# EasyEDA Pro project ProProject_Open Energy Box_2024-08-12.epro, board PCB1
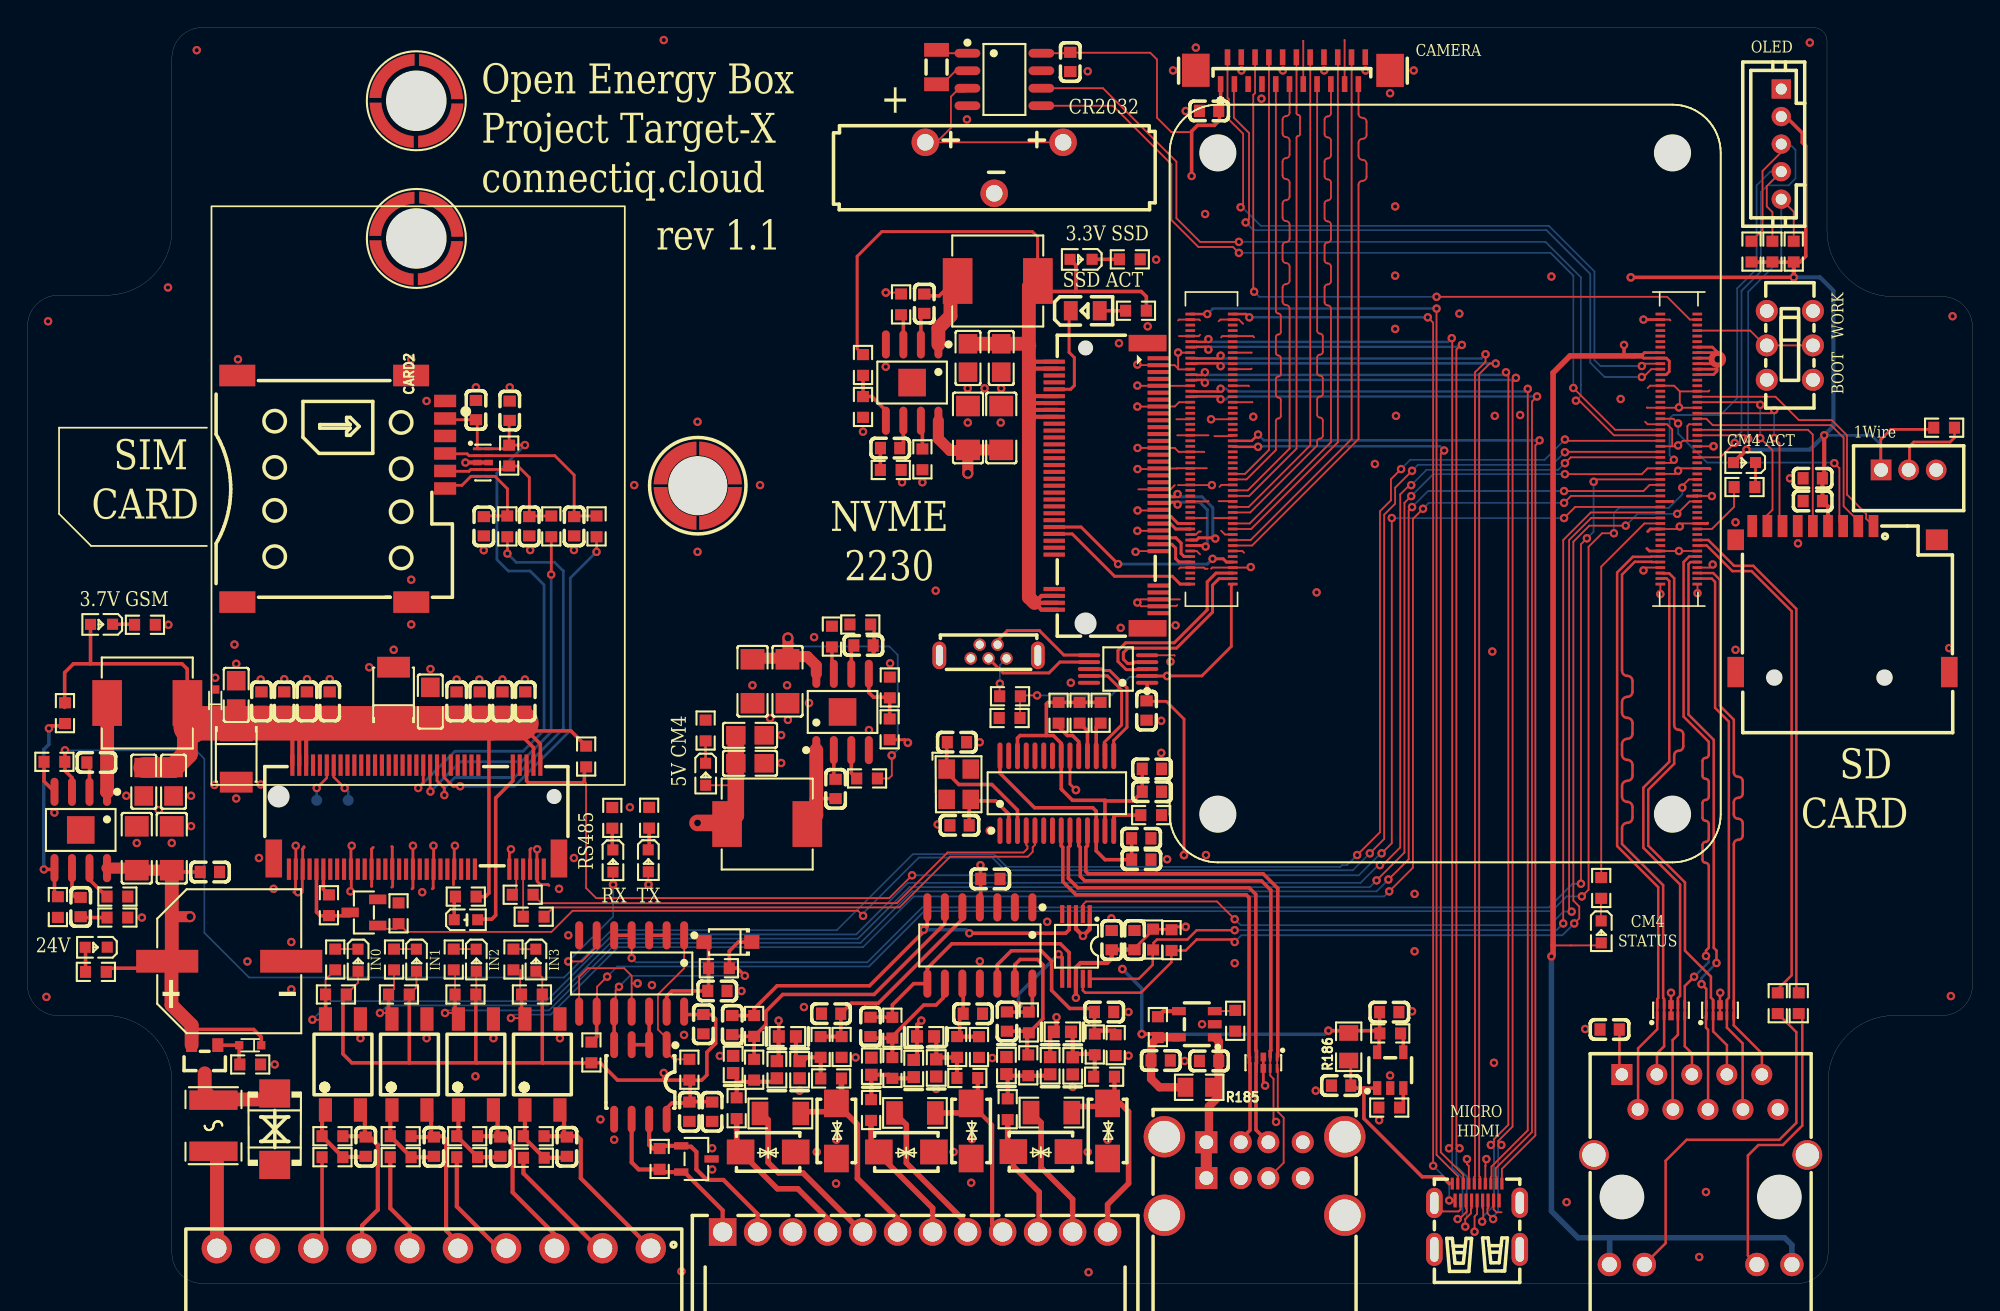
[diagram p13: board, top side]
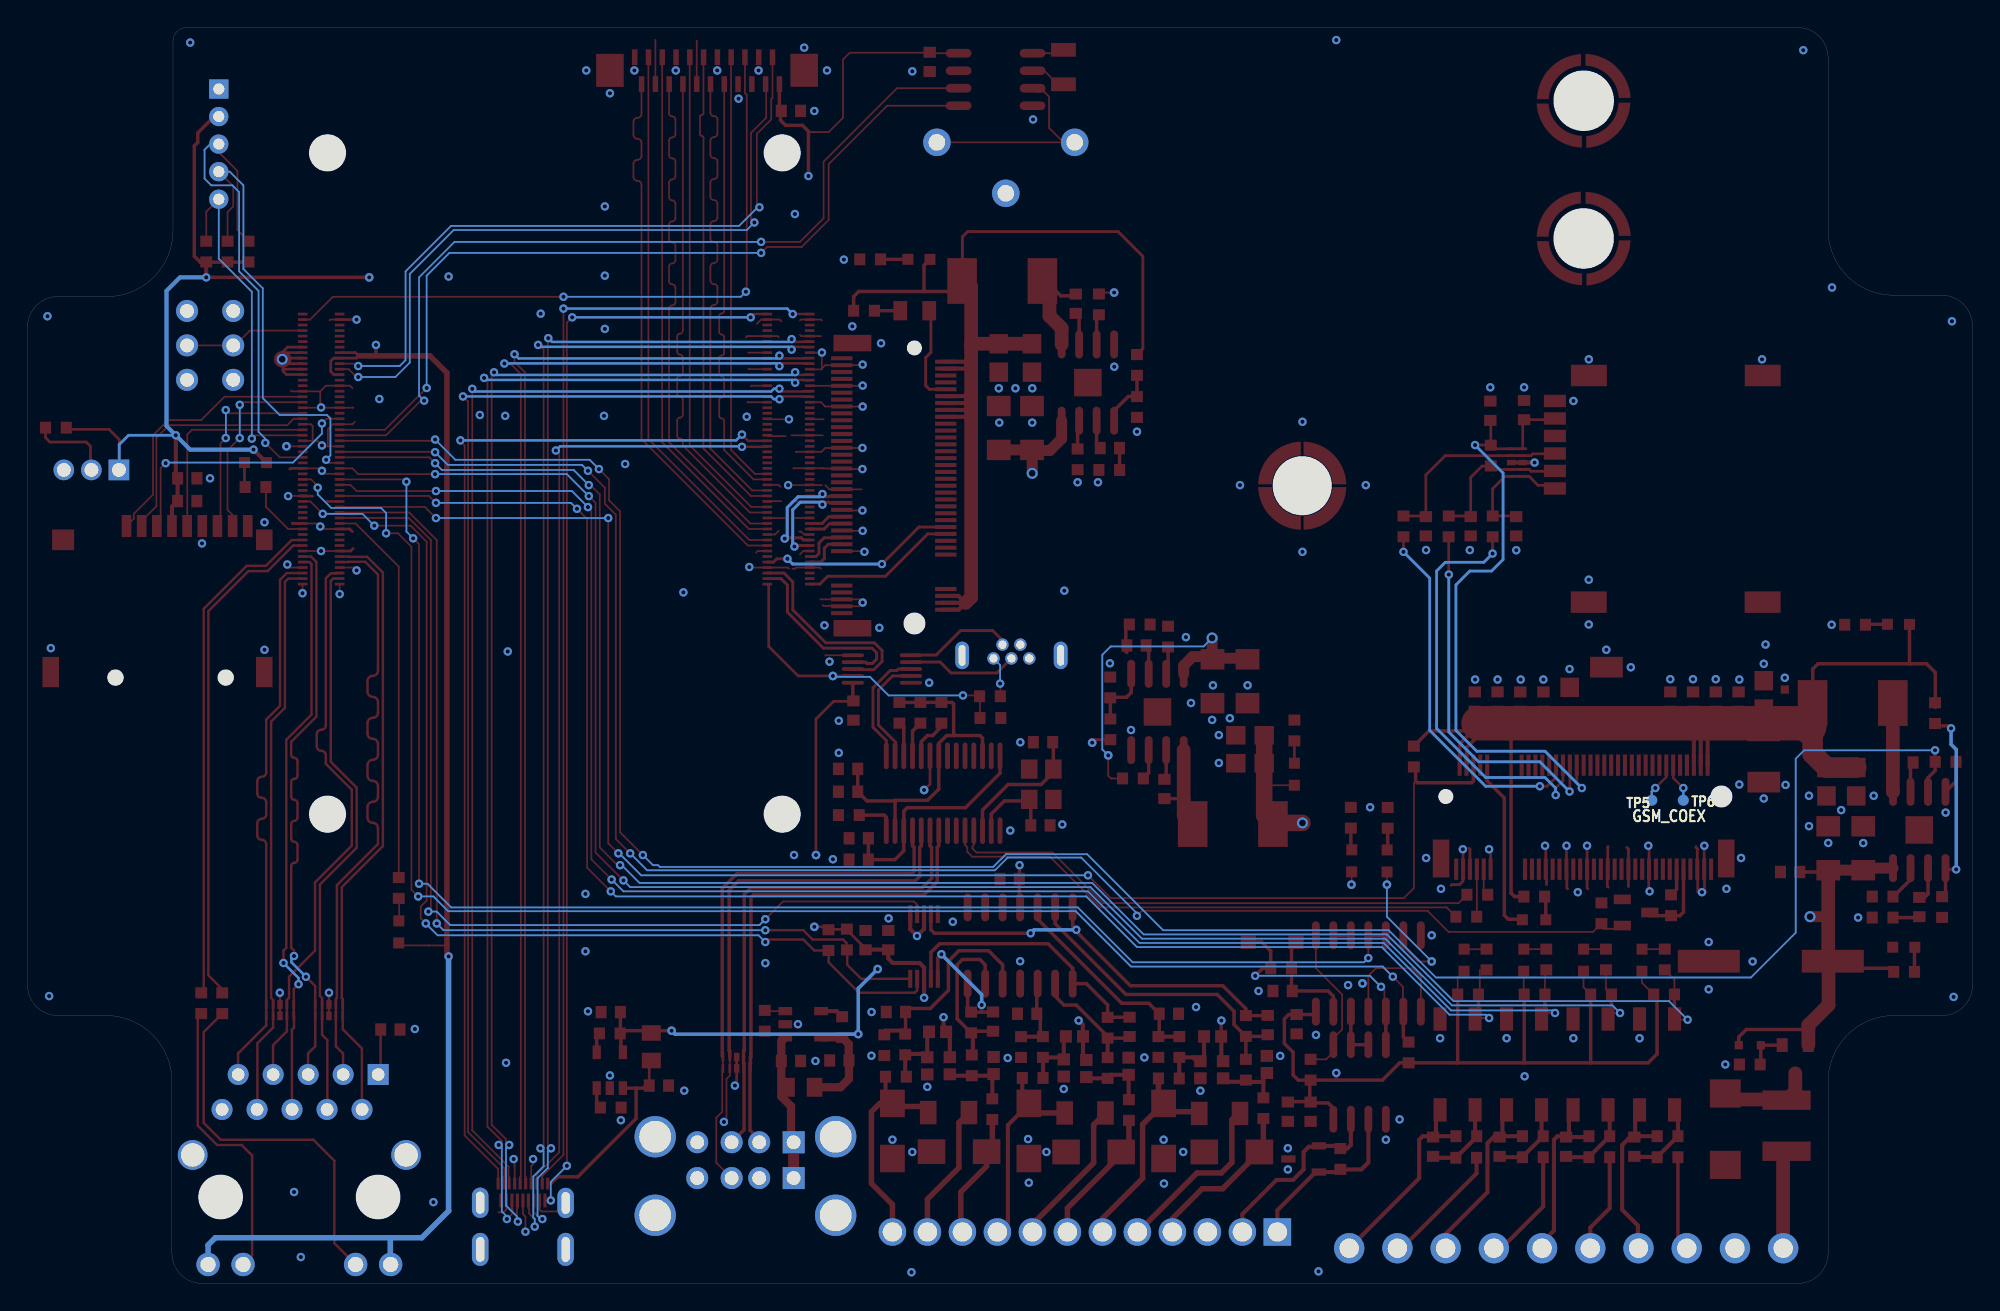
[diagram p14: board, bottom side, seen from below]

Outline 141.16 x 91.16 mm; copper layers: Top Layer, Inner1, Inner2, Bottom Layer. Coordinates in mm from the lower left corner of the outline.
Outline path: 0,69.43 arc(0.62,71.04) 2.2,71.73 5.68,71.73 arc(9.05,73.09) 10.48,76.43 10.48,88.96 arc(11.12,90.51) 12.68,91.16 129.6,91.16 arc(130.3,90.89) 130.61,90.2 130.61,76.43 arc(132.01,73.04) 135.41,71.63 138.96,71.63 arc(140.52,70.99) 141.16,69.43 141.16,21.65 arc(140.52,20.09) 138.96,19.45 135.49,19.45 arc(132.09,18.04) 130.69,14.65 130.69,2.2 arc(130.04,0.64) 128.49,0 12.68,0 arc(11.12,0.64) 10.48,2.2 10.48,14.65 arc(9.07,18.04) 5.68,19.45 2.2,19.45 arc(0.64,20.09) 0,21.65 0,69.43
Stack: Top Layer 0.035mm 外层铜厚1oz / Dielectric1 0.2104mm 7628 RC49% 8.6mil / Inner1 0.0152mm 内层铜厚 / Dielectric2 1.065mm 1.1mm H/HOZ 含铜 / Inner2 0.0152mm 内层铜厚 / Dielectric3 0.2104mm 7628 RC49% 8.6mil / Bottom Layer 0.035mm 外层铜厚1oz

## Design rules (mm)
net PCIE_CLP_P: PCIE_CLP
net PCIE_CLP_N: PCIE_CLP
net PCIE_R0_P: PCIE_R0_
net PCIE_R0_N: PCIE_R0_
net PCIE_T0_P: PCIE_T0_
net PCIE_T0_N: PCIE_T0_
net USB_GSM_P: USB_GSM_
net USB_GSM_N: USB_GSM_
net ETH_P1_P: DP1
net ETH_P1_N: DP1
net ETH_P0_N: ETH_P0_
net ETH_P0_P: ETH_P0_
net HDMI0_TX2_P: HDMI0_TX2_
net HDMI0_TX2_N: HDMI0_TX2_
net HDMI0_TX1_P: HDMI0_TX1_
net HDMI0_TX1_N: HDMI0_TX1_
net HDMI0_TX0_P: HDMI0_TX0_
net HDMI0_TX0_N: HDMI0_TX0_
net HDMI0_CLK_P: HDMI0_CLK_
net HDMI0_CLK_N: HDMI0_CLK_
net CAM1_D0_N: CAM1_D0_
net CAM1_D0_P: CAM1_D0_
net CAM1_D1_N: CAM1_D1_
net CAM1_D1_P: CAM1_D1_
net CAM1_C_N: CAM1_C_
net CAM1_C_P: CAM1_C_
net CAM1_D2_N: CAM1_D2_
net CAM1_D2_P: CAM1_D2_
net CAM1_D3_N: CAM1_D3_
net CAM1_D3_P: CAM1_D3_
net USB_N: USB_
net USB_P: USB_
net USB2_N: USB2_
net USB2_P: USB2_
net USB1_N: USB1_
net USB1_P: USB1_
net ETH_P3_P: ETH_P3_
net ETH_P3_N: ETH_P3_
net ETH_P2_N: ETH_P2_
net ETH_P2_P: ETH_P2_
net U_P: U_
net U_N: U_
net U2_P: U2_
net U2_N: U2_
template: Custom Config
spacing copperThickness1oz (default): track to track 0.102, other pairs 0.152 to 0.3
spacing copperThickness2oz: track to track 0.203, other pairs 0.152 to 0.3
track width copperThickness1oz (default): min 0.127, default 0.254, max 2.54
track width copperThickness2oz: min 0.203, default 0.254, max 2.54
differential pair differentialPair (default): width min 0.127, default 0.254, max 2.54; gap min 0.178, default 0.178
via viaSize (default): diameter min 0.5, default 0.61, max 10; hole min 0.3, default 0.305, max 6.299

## Placement (name value [footprint] x y rotation side)
B1  CR2032-BS-5-1  [BAT-TH_CR2032-BS-5-1]  70.16 80.98 180 top
C2  10uF  [C1206]  10.47 31.59 270 top
C3  10uF  [C1206]  7.93 31.59 270 top
C5  3.3nF  [C0603]  3.85 27.32 270 top
C6  22uF  [C0805]  10.59 36.41 90 top
C7  22uF  [C0805]  8.44 36.41 90 top
C11  10uF  [C1206]  70.67 62.09 270 top
C12  10uF  [C1206]  68.26 62.09 270 top
C13  100nF  [C0603]  65.08 71.11 270 top
C14  3.3nF  [C0603]  62.61 60.63 180 top
C15  22uF  [C0805]  68.26 67.17 90 top
C16  22uF  [C0805]  70.67 67.17 90 top
C18  100nF  [C0603]  129.57 56.79 0 top
C23  100nF  [C0603]  81.61 37.35 180 top
C25  10uF  [C0603]  81.61 35.69 180 top
C26  20pF  [C0603]  67.46 39.28 0 top
C27  20pF  [C0603]  67.65 33.25 0 top
C28  100nF  [C0603]  80.83 32.31 0 top
C29  10uF  [C0603]  80.84 30.76 180 top
C30  10uF  [C0603]  129.57 58.44 0 top
C31  100nF  [C0603]  85.76 85.11 180 top
C32  10uF  [C1206]  52.62 43.71 90 top
C33  10uF  [C1206]  55.16 43.71 90 top
C35  3.3nF  [C0603]  60.67 46.31 0 top
C36  22uF  [C0805]  52.44 37.76 180 top
C37  22uF  [C0805]  52.44 39.79 180 top
C38  220uF  [CAP-SMD_BD10.0-L10.3-W10.3-LS11.3-FD]  14.64 23.39 0 top
C40  100nF  [C0603]  13.23 29.86 180 top
C41  100nF  [C0603]  58.65 35.89 270 top
C44  33pF  [C0603]  16.98 42.24 270 top
C45  33pF  [C0603]  32.54 63.39 270 top
C46  100nF  [C0603]  5.01 37.81 0 top
C47  NM  [C0603]  24.54 9.93 90 top
C48  NM  [C0603]  29.5 9.93 90 top
C49  NM  [C0603]  34.32 9.93 90 top
C50  NM  [C0603]  39.15 9.93 90 top
C51  100nF  [C0603]  75.68 88.66 90 top
C52  100nF  [C0603]  21.93 42.24 270 top
C53  100nF  [C0603]  58.32 19.58 0 top
C54  100nF  [C0603]  51.15 18.75 270 top
C57  100nF  [C0603]  68.61 19.58 180 top
C58  100nF  [C0603]  61.18 18.62 270 top
C59  100nF  [C0603]  78.14 19.7 180 top
C60  100nF  [C0603]  71.09 19.01 270 top
C61  100nF  [C0603]  69.88 29.36 0 top
C62  100nF  [C0603]  80.34 24.92 270 top
C63  10uF  [C0603]  78.69 24.92 270 top
C64  10nF  [C0603]  114.83 18.43 0 top
C66  33pF  [C0603]  50.07 21.23 0 top
C67  100nF  [C0603]  48.04 12.47 90 top
C68  10uF  [C0603]  49.69 12.47 90 top
C69  100nF  [C0603]  49.05 18.82 90 top
C70  10uF  [C0603]  82.24 16.19 180 top
C71  10uF  [C0603]  85.76 16.15 0 top
C72  100nF  [C0603]  81.22 41.58 90 top
C85  10uF  [C0603]  98.83 19.69 180 top
C86  10uF  [C0603]  95.34 14.36 0 top
C88  220uF  [CASE-B_3528]  15.14 38.25 270 top
C93  33pF  [C0603]  31.14 42.24 270 top
C94  100nF  [C0603]  34.47 42.24 270 top
C95  220uF  [CASE-B_3528]  26.57 42.87 90 top
C97  220nF  [C0603]  34.99 63.34 270 top
C98  10pF  [C0603]  18.63 42.24 270 top
C99  1uF  [C0603]  20.28 42.24 270 top
C100  33pF  [C0603]  33.12 54.96 90 top
C101  33pF  [C0603]  36.42 54.96 90 top
C102  33pF  [C0603]  39.67 54.96 90 top
C103  1uF  [C0603]  36.12 42.24 270 top
C104  10pF  [C0603]  32.82 42.24 270 top
C105  22uF  [C0805]  29.23 42.24 270 top
C106  22uF  [C0805]  15.14 42.72 270 top
CARD1  TF PUSH  [TF-SMD_TF-PUSH]  131.73 49.68 0 top
CARD2  SMC-202-6  [SIM-SMD_SMC-202-6]  22.76 57.68 270 top
CN3  AS0BC21-S40BB-7H  [CONN-SMD_AS0BC21-S30BB-7H]  28.22 33.84 180 top
CN5  APCI0113-P001A  [CONN-SMD_APCI0113-P001A]  78.29 57.9 270 top
CN7  XY2500R-G-3.5-10P  [CONN-TH_XY2500R-G-3.5-10P]  29.49 2.56 180 top
CN10  DB2ERC-2.54-12P-GN  [CONN-TH_12P-P2.54_DIBO_DB2ERC-2.54-12P-GN]  64.42 3.73 0 top
CN17  PH-5A  [CONN-TH_5P-P2.00_PH-5A]  127.29 82.7 270 top
CN20  HYC23-HDMID19-650  [AUDIO-TH_HYC23-HDMID19-650]  105.21 4.86 0 top
CN21  PH-3A  [CONN-TH_3P-P2.00_HCTL_PH-3A_C2908624]  136.53 59.05 0 top
D1  ESD0603E002M05  [D0603-BI]  51.21 15.89 270 top
D2  ESD0603E002M05  [D0603-BI]  54.39 15.51 90 top
D3  ESD0603E002M05  [D0603-BI]  55.15 17.93 180 top
D4  ESD0603E002M05  [D0603-BI]  56.04 15.51 90 top
D5  BV-SMAJ30CA  [SMA_L4.4-W2.6-LS5.0-BI]  58.71 11.07 90 top
D6  BV-SMAJ30CA  [SMA_L4.4-W2.6-LS5.0-BI]  53.75 9.54 0 top
D19  P6SMB27CA/TR13  [SMB_L4.3-W3.6-LS5.4-BI]  17.94 11.2 90 top
D27  ESD0603E002M05  [D0603-BI]  61.25 15.77 270 top
D28  ESD0603E002M05  [D0603-BI]  64.32 15.6 90 top
D29  ESD0603E002M05  [D0603-BI]  65.18 17.93 180 top
D30  ESD0603E002M05  [D0603-BI]  65.95 15.64 90 top
D31  BV-SMAJ30CA  [SMA_L4.4-W2.6-LS5.0-BI]  68.48 11.07 90 top
D32  BV-SMAJ30CA  [SMA_L4.4-W2.6-LS5.0-BI]  63.79 9.54 0 top
D33  ESD0603E002M05  [D0603-BI]  71.05 15.82 270 top
D34  ESD0603E002M05  [D0603-BI]  74.22 15.8 90 top
D35  ESD0603E002M05  [D0603-BI]  75.11 18.26 180 top
D36  ESD0603E002M05  [D0603-BI]  75.86 15.79 90 top
D37  BV-SMAJ30CA  [SMA_L4.4-W2.6-LS5.0-BI]  78.39 11.07 90 top
D38  BV-SMAJ30CA  [SMA_L4.4-W2.6-LS5.0-BI]  73.55 9.57 0 top
D39  PSM712-LF-T7  [SOT-23-3_L3.0-W1.7-P0.95-LS2.9-BR]  48.55 9.04 180 top
D40  1N4148W  [SOD-123F_L2.7-W1.6-LS3.8-RD]  50.83 24.78 180 top
D43  MM5Z4V7  [SOD-523_L1.2-W0.8-LS1.6-FD]  13.62 42.31 270 top
D44  MM5Z4V7  [SOD-523_L1.2-W0.8-LS1.6-FD]  16.16 17.29 0 top
F1  BSMD1812-200-30V  [F1812]  13.49 11.45 90 top
FPC8  AFC11-S22ICC-00  [FPC-SMD_22P-P1.00_AFC11-S22ICC-00]  91.84 88.03 0 top
L1  4.7uH  [IND-SMD_L7.1-W6.6]  8.69 42.13 0 top
L3  4.7uH  [IND-SMD_L7.1-W6.6]  70.42 72.76 0 top
L4  4.7uH  [IND-SMD_L7.1-W6.6]  53.68 33.34 180 top
LED2  -  [LED0603-R-RD]  31.82 26.4 0 top
LED6  19-217/GHC-YR1S2/3T  [LED0603-RD]  4.98 24.4 180 top
LED7  19-217/GHC-YR1S2/3T  [LED0603-RD]  49.21 36.96 270 top
LED8  19-217/GHC-YR1S2/3T  [LED0603-RD]  5.37 47.84 180 top
LED9  KT-0805Y  [LED0805-R-RD]  76.77 70.6 0 top
LED10  19-217/GHC-YR1S2/3T  [LED0603-RD]  76.47 74.33 180 top
LED11  19-217/GHC-YR1S2/3T  [LED0603-RD]  42.48 30.67 270 top
LED12  19-217/GHC-YR1S2/3T  [LED0603-RD]  45.05 30.68 270 top
LED13  19-217/GHC-YR1S2/3T  [LED0603-RD]  124.62 59.58 180 top
LED14  19-217/GHC-YR1S2/3T  [LED0603-RD]  114.22 25.52 270 top
LED15  19-217/GHC-YR1S2/3T  [LED0603-RD]  23.99 23.46 270 top
LED16  19-217/GHC-YR1S2/3T  [LED0603-RD]  28.23 23.46 270 top
LED17  19-217/GHC-YR1S2/3T  [LED0603-RD]  32.57 23.46 270 top
LED18  19-217/GHC-YR1S2/3T  [LED0603-RD]  36.9 23.46 270 top
P4  SMTSO3035CTJ  [SMD_BD5.6-D4.1]  48.65 57.9 0 top
Q2  AO3401A  [SOT-23_L2.9-W1.3-P1.90-LS2.4-BR]  12.86 16.15 90 top
Q8  2N7002  [SOT-23-3_L2.9-W1.3-P1.90-LS2.4-BR]  24.41 26.93 0 top
R4  13K  [R0603]  6.52 26.56 180 top
R5  36.5K  [R0603]  2.71 41.39 90 top
R6  10K  [R0603]  2.2 27.32 90 top
R7  300  [R0603]  8.52 47.81 180 top
R8  15k  [R0603]  34.96 60.09 90 top
R10  1k  [R0603]  31.81 28.08 180 top
R11  100K  [R0603]  40.54 38.25 270 top
R13  1k  [R0603]  80.45 70.6 180 top
R17  13K  [R0603]  62.65 59.05 180 top
R18  30.9K  [R0603]  60.64 66.67 90 top
R19  10K  [R0603]  60.64 63.62 90 top
R20  300  [R0603]  80 74.33 180 top
R35  249kΩ  [R1206]  54.64 12.34 0 top
R46  2.7K  [R0603]  81.55 33.99 180 top
R47  100kΩ  [R0603]  77.88 41.42 90 top
R48  100kΩ  [R0603]  76.36 41.42 90 top
R49  100kΩ  [R0603]  74.83 41.42 90 top
R54  20K  [R0603]  60.44 47.83 0 top
R56  10K  [R0603]  62.58 43.26 270 top
R57  300  [R0603]  49.21 40.13 270 top
R59  2.2kΩ  [R0603]  4.96 22.61 0 top
R60  52.3kΩ  [R0603]  62.57 40.22 270 top
R70  510Ω  [R0603]  22.13 10.69 180 top
R71  510Ω  [R0603]  27.08 10.69 180 top
R72  510Ω  [R0603]  31.91 10.69 180 top
R73  510Ω  [R0603]  36.73 10.69 180 top
R74  510Ω  [R0603]  127.03 20.34 90 top
R75  510Ω  [R0603]  128.56 20.34 90 top
R78  137kΩ  [R0603]  60.93 36.65 180 top
R79  137kΩ  [R0603]  58.38 46.95 270 top
R80  137kΩ  [R0603]  16.16 15.89 180 top
R81  137kΩ  [R0603]  1.95 37.86 0 top
R82  137kΩ  [R0603]  6.52 28.08 180 top
R83  137kΩ  [R0603]  63.4 71.06 270 top
R84  137kΩ  [R0603]  64.95 59.82 90 top
R85  137kΩ  [R0603]  58.32 14.88 0 top
R86  137kΩ  [R0603]  51.47 12.72 270 top
R87  100Ω  [R0603]  52.74 15.51 90 top
R88  100Ω  [R0603]  57.56 17.16 90 top
R89  33kΩ  [R0603]  52.74 18.69 90 top
R90  33kΩ  [R0603]  59.09 17.16 90 top
R98  249kΩ  [R1206]  64.41 12.38 0 top
R99  137kΩ  [R0603]  68.21 14.91 0 top
R100  137kΩ  [R0603]  61.22 12.59 270 top
R101  100Ω  [R0603]  62.77 15.64 90 top
R102  100Ω  [R0603]  67.47 17.16 90 top
R103  33kΩ  [R0603]  62.77 18.56 90 top
R104  33kΩ  [R0603]  69.06 17.16 90 top
R105  249kΩ  [R1206]  74.31 12.4 0 top
R106  137kΩ  [R0603]  78.14 15.01 0 top
R107  137kΩ  [R0603]  71.14 12.65 270 top
R108  100Ω  [R0603]  72.63 15.83 90 top
R109  100Ω  [R0603]  77.46 17.35 90 top
R110  33kΩ  [R0603]  72.68 18.94 90 top
R111  33kΩ  [R0603]  78.98 17.3 90 top
R112  120Ω  [R0603]  45.88 9.04 90 top
R113  4.7kΩ  [R0603]  22.13 9.16 0 top
R114  4.7kΩ  [R0603]  27.08 9.16 0 top
R115  4.7kΩ  [R0603]  31.91 9.16 0 top
R116  4.7kΩ  [R0603]  36.75 9.12 0 top
R117  4.7kΩ  [R0603]  36.61 20.97 0 top
R118  4.7kΩ  [R0603]  31.78 20.97 0 top
R119  4.7kΩ  [R0603]  26.96 20.97 0 top
R120  4.7kΩ  [R0603]  22.38 20.97 0 top
R121  4.7kΩ  [R0603]  48.04 15.51 270 top
R122  300  [R0603]  42.44 33.79 270 top
R123  4.7kΩ  [R0603]  40.93 16.77 270 top
R124  52.3kΩ  [R0603]  50.18 22.88 180 top
R125  300  [R0603]  45.12 33.8 270 top
R126  300  [R0603]  124.62 57.8 0 top
R127  2.7K  [R0603]  71.31 42.62 180 top
R128  2.7K  [R0603]  71.28 41.04 0 top
R129  13K  [R0603]  87.65 19.07 90 top
R130  13K  [R0603]  82.04 18.61 90 top
R137  4.7kΩ  [R0603]  81.69 24.96 90 top
R138  4.7kΩ  [R0603]  83.03 24.92 90 top
R162  13K  [R0603]  98.9 18.15 0 top
R163  13K  [R0603]  98.83 12.77 0 top
R165  NM  [R0603]  21.88 27.45 90 top
R166  100K  [R0603]  26.93 26.87 90 top
R167  22Ω  [R0603]  34.82 54.95 270 top
R168  22Ω  [R0603]  38.01 54.95 270 top
R169  22Ω  [R0603]  41.3 54.95 270 top
R170  0R  [R0603]  36.74 26.62 180 top
R171  0R  [R0603]  35.94 28.21 180 top
R172  300  [R0603]  114.22 28.7 270 top
R173  4.7K  [R0603]  128.19 74.9 270 top
R178  4.7K  [R0603]  125.13 74.9 270 top
R179  4.7K  [R0603]  126.64 74.9 270 top
R180  300  [R0603]  22.33 23.51 90 top
R181  300  [R0603]  26.6 23.51 90 top
R182  300  [R0603]  30.93 23.51 90 top
R183  300  [R0603]  35.27 23.51 90 top
R184  4.7kΩ  [R0603]  139.11 62.11 180 top
R185  0Ω  [R0805]  85.04 14.24 180 top
R186  0Ω  [R0805]  95.89 17.18 90 top
RJ2  HR911130A  [RJ45-TH_HR911130A]  121.44 8.27 180 top
SW1  MSS22D18G2 125  [SW-TH_SHOU_MSS22D18G2]  127.91 68.09 90 top
TP5  -  [test-point-0.5mm]  23.27 35.07 180 bottom
TP6  -  [test-point-0.5mm]  20.99 35.07 180 bottom
U3  RT7272BGSP  [SOIC-8_L5.0-W4.0-P1.27-LS6.0-BL-EP2.0]  3.86 32.91 180 top
U4  RT7272BGSP  [SOIC-8_L5.0-W4.0-P1.27-LS6.0-BL-EP2.0]  64.2 65.39 180 top
U6  EL357N(B)(TA)-G  [OPTO-SMD-4_L4.4-W4.1-P2.54-LS7.0-TL]  22.89 15.89 90 top
U8  ADS1015IDGSR  [VSSOP-10_L3.0-W3.0-P0.50-LS4.9-BL]  76.1 24.46 180 top
U10  SL2.2s  [SSOP-28_L9.9-W3.9-P0.64-LS6.0-BL]  74.71 35.58 0 top
U12  SMTSO3025MTJ  [SMD_SMTSO3060CTJ]  28.22 75.84 270 top
U14  RT7272BGSP  [SOIC-8_L5.0-W4.0-P1.27-LS6.0-BL-EP2.0]  59.15 41.48 0 top
U15  EL357N(B)(TA)-G  [OPTO-SMD-4_L4.4-W4.1-P2.54-LS7.0-TL]  27.72 15.89 90 top
U16  EL357N(B)(TA)-G  [OPTO-SMD-4_L4.4-W4.1-P2.54-LS7.0-TL]  32.54 15.89 90 top
U17  EL357N(B)(TA)-G  [OPTO-SMD-4_L4.4-W4.1-P2.54-LS7.0-TL]  37.37 15.89 90 top
U19  XL1307  [SOP-8_L4.9-W3.9-P1.27-LS6.0-BL]  70.9 87.39 270 top
U20  TPD4EUSB30DQAR-N  [DFN-10_L2.5-W1.0-P0.50-BL-A]  122.84 19.83 0 top
U21  TPD4EUSB30DQAR-N  [DFN-10_L2.5-W1.0-P0.50-BL-A]  119.28 19.83 0 top
U22  LM324DT  [SOIC-14_L8.7-W3.9-P1.27-LS6.0-BL]  69.12 24.53 180 top
U23  SP3485EN-L/TR  [SOIC-8_L5.0-W4.0-P1.27-LS6.0-BL]  44.48 14.62 180 top
U24  74HC14D,653  [SOIC-14_L8.7-W3.9-P1.27-LS6.0-BL]  43.85 22.5 180 top
U25  MT9700  [SOT-23-5_L3.0-W1.7-P0.95-LS2.8-BR]  84.87 18.82 0 top
U28  FSUSB42MUX  [MSOP-10_L3.0-W3.0-P0.50-LS5.0-BL]  79.15 44.6 90 top
U31  TPD4EUSB30DQAR-N  [DFN-10_L2.5-W1.0-P0.50-BL-A]  89.69 16.02 180 top
U33  TPD4EUSB30DQAR-N  [DFN-10_L2.5-W1.0-P0.50-BL-A]  33.05 59.58 270 top
U41  MT9700  [SOT-23-5_L3.0-W1.7-P0.95-LS2.8-BR]  98.9 15.48 270 top
U45  CM4 Left  [CM4 LEFT]  97.95 59.46 0 top
U46  CM4 Right  [CM4 RIGHT]  97.95 59.46 0 top
U48  SMTSO3025MTJ  [SMD_SMTSO3060CTJ]  28.22 85.84 0 top
USB7  AF SS-JB17.6  [USB-A-TH_AF-SS-JB17.6]  89.06 7.8 0 top
USB8  MICRO 180°ZB  [MICRO-USB-TH_MICRO-180-ZB]  69.75 45.87 180 top
X1  12MHz  [OSC-SMD_4P-L3.2-W2.5-BL]  67.58 36.23 270 top
X2  32.768kHz  [FC-135R_L3.2-W1.5]  65.98 88.29 90 top

## Footprints (pads in the part's own frame, mm; a bottom-side part is the same pattern mirrored in y, then rotated)
AUDIO-TH_HYC23-HDMID19-650
  rect 0.23x0.85 smd: 1(1.8,2.388) 3(1.4,2.388) 5(1,2.388) 7(0.6,2.388) 9(0.2,2.388) 11(-0.2,2.388) 13(-0.6,2.388) 15(-1,2.388) 17(-1.4,2.388) 19(-1.8,2.388)
  rect 0.23x1 smd: 2(1.6,1.163) 4(1.2,1.163) 6(0.8,1.163) 8(0.4,1.163) 10(0,1.163) 12(-0.4,1.163) 14(-0.8,1.163) 16(-1.2,1.163) 18(-1.6,1.163)
  oval 1.2x2.2 hole 0.6x1.6: 20(-3.1,0.983) 20(3.1,1)
  oval 1.2x2.4 hole 0.6x1.8: 20(-3.1,-2.388) 20(3.1,-2.388)
BAT-TH_CR2032-BS-5-1
  round 2 hole 1.2: 1(-5,-1.85) 1(5,-1.85) 2(0,1.85)
C0603
  rect 0.8x0.9 smd: 1(-0.7,0) 2(0.7,0)
C0805
  rect 1.41x1.35 smd: 1(-1.03,0) 2(1.03,0)
C1206
  rect 1.485x1.728 smd: 1(-1.593,0) 2(1.593,0)
CAP-SMD_BD10.0-L10.3-W10.3-LS11.3-FD
  rect 4.5x1.65 smd: 1(-4.5,0) 2(4.5,0)
CASE-B_3528
  rect 1.506x2.376 smd: 1(-1.861,0) 2(1.861,0)
CM4 LEFT
  custom 0.7x0.2 smd: 1(23.243,-8.694) 2(20.563,-8.694) 3(23.243,-8.294) 4(20.563,-8.294) 5(23.243,-7.894) 6(20.563,-7.894) 7(23.243,-7.494) 8(20.563,-7.494) 9(23.243,-7.094) 10(20.563,-7.094) 11(23.243,-6.694) 12(20.563,-6.694) 13(23.243,-6.294) 14(20.563,-6.294) 15(23.243,-5.894) 16(20.563,-5.894) 17(23.243,-5.494) 18(20.563,-5.494) 19(23.243,-5.094) 20(20.563,-5.094) 21(23.243,-4.694) 22(20.563,-4.694) 23(23.243,-4.294) 24(20.563,-4.294) 25(23.243,-3.894) 26(20.563,-3.894) 27(23.243,-3.494) 28(20.563,-3.494) 29(23.243,-3.094) 30(20.563,-3.094) 31(23.243,-2.694) 32(20.563,-2.694) 33(23.243,-2.294) 34(20.563,-2.294) 35(23.243,-1.894) 36(20.563,-1.894) 37(23.243,-1.494) 38(20.563,-1.494) 39(23.243,-1.094) 40(20.563,-1.094) 41(23.243,-0.694) 42(20.563,-0.694) 43(23.243,-0.294) 44(20.563,-0.294) 45(23.243,0.106) 46(20.563,0.106) 47(23.243,0.506) 48(20.563,0.506) 49(23.243,0.906) 50(20.563,0.906) 51(23.243,1.306) 52(20.563,1.306) 53(23.243,1.706) 54(20.563,1.706) 55(23.243,2.106) 56(20.563,2.106) 57(23.243,2.506) 58(20.563,2.506) 59(23.243,2.906) 60(20.563,2.906) 61(23.243,3.306) 62(20.563,3.306) 63(23.243,3.706) 64(20.563,3.706) 65(23.243,4.106) 66(20.563,4.106) 67(23.243,4.506) 68(20.563,4.506) 69(23.243,4.906) 70(20.563,4.906) 71(23.243,5.306) 72(20.563,5.306) 73(23.243,5.706) 74(20.563,5.706) 75(23.243,6.106) 76(20.563,6.106) 77(23.243,6.506) 78(20.563,6.506) 79(23.243,6.906) 80(20.563,6.906) 81(23.243,7.306) 82(20.563,7.306) 83(23.243,7.706) 84(20.563,7.706) 85(23.243,8.106) 86(20.563,8.106) 87(23.243,8.506) 88(20.563,8.506) 89(23.243,8.906) 90(20.563,8.906) 91(23.243,9.306) 92(20.563,9.306) 93(23.243,9.706) 94(20.563,9.706) 95(23.243,10.106) 96(20.563,10.106) 97(23.243,10.506) 98(20.563,10.506) 99(23.243,10.906) 100(20.563,10.906)
CM4 RIGHT
  custom 0.7x0.2 smd: 101(-10.477,-8.694) 102(-13.557,-8.694) 103(-10.477,-8.294) 104(-13.557,-8.294) 105(-10.477,-7.894) 106(-13.557,-7.894) 107(-10.477,-7.494) 108(-13.557,-7.494) 109(-10.477,-7.094) 110(-13.557,-7.094) 111(-10.477,-6.694) 112(-13.557,-6.694) 113(-10.477,-6.294) 114(-13.557,-6.294) 115(-10.477,-5.894) 116(-13.557,-5.894) 117(-10.477,-5.494) 118(-13.557,-5.494) 119(-10.477,-5.094) 120(-13.557,-5.094) 121(-10.477,-4.694) 122(-13.557,-4.694) 123(-10.477,-4.294) 124(-13.557,-4.294) 125(-10.477,-3.894) 126(-13.557,-3.894) 127(-10.477,-3.494) 128(-13.557,-3.494) 129(-10.477,-3.094) 130(-13.557,-3.094) 131(-10.477,-2.694) 132(-13.557,-2.694) 133(-10.477,-2.294) 134(-13.557,-2.294) 135(-10.477,-1.894) 136(-13.557,-1.894) 137(-10.477,-1.494) 138(-13.557,-1.494) 139(-10.477,-1.094) 140(-13.557,-1.094) 141(-10.477,-0.694) 142(-13.557,-0.694) 143(-10.477,-0.294) 144(-13.557,-0.294) 145(-10.477,0.106) 146(-13.557,0.106) 147(-10.477,0.506) 148(-13.557,0.506) 149(-10.477,0.906) 150(-13.557,0.906) 151(-10.477,1.306) 152(-13.557,1.306) 153(-10.477,1.706) 154(-13.557,1.706) 155(-10.477,2.106) 156(-13.557,2.106) 157(-10.477,2.506) 158(-13.557,2.506) 159(-10.477,2.906) 160(-13.557,2.906) 161(-10.477,3.306) 162(-13.557,3.306) 163(-10.477,3.706) 164(-13.557,3.706) 165(-10.477,4.106) 166(-13.557,4.106) 167(-10.477,4.506) 168(-13.557,4.506) 169(-10.477,4.906) 170(-13.557,4.906) 171(-10.477,5.306) 172(-13.557,5.306) 173(-10.477,5.706) 174(-13.557,5.706) 175(-10.477,6.106) 176(-13.557,6.106) 177(-10.477,6.506) 178(-13.557,6.506) 179(-10.477,6.906) 180(-13.557,6.906) 181(-10.477,7.306) 182(-13.557,7.306) 183(-10.477,7.706) 184(-13.557,7.706) 185(-10.477,8.106) 186(-13.557,8.106) 187(-10.477,8.506) 188(-13.557,8.506) 189(-10.477,8.906) 190(-13.557,8.906) 191(-10.477,9.306) 192(-13.557,9.306) 193(-10.477,9.706) 194(-13.557,9.706) 195(-10.477,10.106) 196(-13.557,10.106) 197(-10.477,10.506) 198(-13.557,10.506) 199(-10.477,10.906) 200(-13.557,10.906)
CONN-SMD_APCI0113-P001A
  rect 0.3x1.55 smd: 1(-9.25,3.775) 2(-9,-3.775) 3(-8.75,3.775) 4(-8.5,-3.775) 5(-8.25,3.775) 6(-8,-3.775) 7(-7.75,3.775) 8(-7.5,-3.775) 9(-7.25,3.775) 10(-7,-3.775) 11(-6.75,3.775) 12(-6.5,-3.775) 13(-6.25,3.775) 14(-6,-3.775) 15(-5.75,3.775) 16(-5.5,-3.775) 17(-5.25,3.775) 18(-5,-3.775) 19(-4.75,3.775) 20(-4.5,-3.775) 21(-4.25,3.775) 22(-4,-3.775) 23(-3.75,3.775) 24(-3.5,-3.775) 25(-3.25,3.775) 26(-3,-3.775) 27(-2.75,3.775) 28(-2.5,-3.775) 29(-2.25,3.775) 30(-2,-3.775) 31(-1.75,3.775) 32(-1.5,-3.775) 33(-1.25,3.775) 34(-1,-3.775) 35(-0.75,3.775) 36(-0.5,-3.775) 37(-0.25,3.775) 38(0,-3.775) 39(0.25,3.775) 40(0.5,-3.775) 41(0.75,3.775) 42(1,-3.775) 43(1.25,3.775) 44(1.5,-3.775) 45(1.75,3.775) 46(2,-3.775) 47(2.25,3.775) 48(2.5,-3.775) 49(2.75,3.775) 50(3,-3.775) 51(3.25,3.775) 52(3.5,-3.775) 53(3.75,3.775) 54(4,-3.775) 55(4.25,3.775) 56(4.5,-3.775) 57(4.75,3.775) 58(5,-3.775) 67(7.25,3.775) 68(7.5,-3.775) 69(7.75,3.775) 70(8,-3.775) 71(8.25,3.775) 72(8.5,-3.775) 73(8.75,3.775) 74(9,-3.775) 75(9.25,3.775)
  rect 1.2x2.75 smd: 76(-10.35,3) 77(10.35,3)
CONN-SMD_AS0BC21-S30BB-7H
  rect 0.3x1.55 smd: 1(-9.25,3.775) 2(-9,-3.775) 3(-8.75,3.775) 4(-8.5,-3.775) 5(-8.25,3.775) 6(-8,-3.775) 7(-7.75,3.775) 8(-7.5,-3.775) 9(-7.25,3.775) 10(-7,-3.775) 11(-6.75,3.775) 20(-4.5,-3.775) 21(-4.25,3.775) 22(-4,-3.775) 23(-3.75,3.775) 24(-3.5,-3.775) 25(-3.25,3.775) 26(-3,-3.775) 27(-2.75,3.775) 28(-2.5,-3.775) 29(-2.25,3.775) 30(-2,-3.775) 31(-1.75,3.775) 32(-1.5,-3.775) 33(-1.25,3.775) 34(-1,-3.775) 35(-0.75,3.775) 36(-0.5,-3.775) 37(-0.25,3.775) 38(0,-3.775) 39(0.25,3.775) 40(0.5,-3.775) 41(0.75,3.775) 42(1,-3.775) 43(1.25,3.775) 44(1.5,-3.775) 45(1.75,3.775) 46(2,-3.775) 47(2.25,3.775) 48(2.5,-3.775) 49(2.75,3.775) 50(3,-3.775) 51(3.25,3.775) 52(3.5,-3.775) 53(3.75,3.775) 54(4,-3.775) 55(4.25,3.775) 56(4.5,-3.775) 57(4.75,3.775) 58(5,-3.775) 59(5.25,3.775) 60(5.5,-3.775) 61(5.75,3.775) 62(6,-3.775) 63(6.25,3.775) 64(6.5,-3.775) 65(6.75,3.775) 66(7,-3.775) 67(7.25,3.775) 68(7.5,-3.775) 69(7.75,3.775) 70(8,-3.775) 71(8.25,3.775) 72(8.5,-3.775) 73(8.75,3.775) 74(9,-3.775) 75(9.25,3.775)
  rect 1.2x2.75 smd: 76(10.35,3) 77(-10.35,3)
CONN-TH_3P-P2.00_HCTL_PH-3A_C2908624
  rect 1.5x1.5 hole 1: 1(-2,0)
  round 1.5 hole 1: 2(0,0) 3(2,0)
CONN-TH_5P-P2.00_PH-5A
  rect 1.4x1.4 hole 0.8: 1(-4,0)
  round 1.4 hole 0.8: 2(-2,0) 3(0,0) 4(2,0) 5(4,0)
CONN-TH_12P-P2.54_DIBO_DB2ERC-2.54-12P-GN
  rect 2x2 hole 1.4: 1(-13.97,0)
  round 2 hole 1.4: 2(-11.43,0) 3(-8.89,0) 4(-6.35,0) 5(-3.81,0) 6(-1.27,0) 7(1.27,0) 8(3.81,0) 9(6.35,0) 10(8.89,0) 11(11.43,0) 12(13.97,0)
CONN-TH_XY2500R-G-3.5-10P
  round 2.2 hole 1.4: 1(-15.75,0) 2(-12.25,0) 3(-8.75,0) 4(-5.25,0) 5(-1.75,0) 6(1.75,0) 7(5.25,0) 8(8.75,0) 9(12.25,0) 10(15.75,0)
D0603-BI
  rect 0.873x0.907 smd: 1(-0.622,0) 2(0.622,0)
DFN-10_L2.5-W1.0-P0.50-BL-A
  rect 0.2x0.633 smd: 1(-1,-0.411) 2(-0.5,-0.411) 4(0.5,-0.411) 5(1,-0.411) 6(1,0.411) 7(0.5,0.411) 9(-0.5,0.411) 10(-1,0.411)
  rect 0.4x0.633 smd: 3(0,-0.411) 8(0,0.411)
F1812
  rect 1.407x3.499 smd: 1(-1.853,0) 2(1.853,0)
FC-135R_L3.2-W1.5
  rect 1x1.8 smd: 1(-1.25,0) 2(1.25,0)
FPC-SMD_22P-P1.00_AFC11-S22ICC-00
  rect 0.4x1.15 smd: 1(-5.25,-0.975) 2(-4.75,0.975) 3(-4.25,-0.975) 4(-3.75,0.975) 5(-3.25,-0.975) 6(-2.75,0.975) 7(-2.25,-0.975) 8(-1.75,0.975) 9(-1.25,-0.975) 10(-0.75,0.975) 11(-0.25,-0.975) 12(0.25,0.975) 13(0.75,-0.975) 14(1.25,0.975) 15(1.75,-0.975) 16(2.25,0.975) 17(2.75,-0.975) 18(3.25,0.975) 19(3.75,-0.975) 20(4.25,0.975) 21(4.75,-0.975) 22(5.25,0.975)
  rect 2x2.4 smd: 23(7.05,0.021) 24(-7.05,0.029)
IND-SMD_L7.1-W6.6
  rect 2.15x3.32 smd: 1(-2.913,0) 2(2.913,0)
LED0603-R-RD
  rect 0.8x0.8 smd: 1(0.851,0) 2(-0.851,0)
LED0603-RD
  rect 0.8x0.8 smd: 1(-0.799,-0.004) 2(0.799,0.004)
LED0805-R-RD
  rect 1x1.399 smd: 1(1.05,0) 2(-1.05,0)
MICRO-USB-TH_MICRO-180-ZB
  round 0.9 hole 0.6: 1(-1.3,0.5) 2(-0.65,-0.5) 3(0,0.5) 4(0.65,-0.5) 5(1.3,0.5)
  oval 1x2 hole 0.5x1.5: 6(-3.575,0.28) 6(3.575,0.28)
MSOP-10_L3.0-W3.0-P0.50-LS5.0-BL
  oval 0.28x1.62 smd: 1(-1,-2.11) 2(-0.5,-2.11) 3(0,-2.11) 4(0.5,-2.11) 5(1,-2.11) 6(1,2.11) 7(0.5,2.11) 8(0,2.11) 9(-0.5,2.11) 10(-1,2.11)
OPTO-SMD-4_L4.4-W4.1-P2.54-LS7.0-TL
  rect 1.7x0.95 smd: 1(-3.3,1.27) 2(-3.3,-1.27) 3(3.3,-1.27) 4(3.3,1.27)
OSC-SMD_4P-L3.2-W2.5-BL
  rect 1.4x1.2 smd: 1(-1.1,-0.875) 2(1.1,-0.875) 3(1.1,0.875) 4(-1.1,0.875)
R0603
  rect 0.806x0.864 smd: 1(-0.753,0) 2(0.753,0)
R0805
  rect 1.133x1.377 smd: 1(-1,0) 2(1,0)
R1206
  rect 1.208x1.701 smd: 1(-1.479,0) 2(1.479,0)
RJ45-TH_HR911130A
  round 1.7 hole 1.1: 11(6.625,6.895) 12(4.085,6.895) 13(-4.085,6.895) 14(-6.625,6.895)
  rect 1.524x1.524 hole 0.91: P1(5.72,-6.895)
  round 1.524 hole 0.91: P2(4.549,-4.355) P3(3.18,-6.895) P4(2.009,-4.355) P5(0.64,-6.895) P6(-0.531,-4.355) P7(-1.9,-6.895) P8(-3.071,-4.355) P9(-4.44,-6.895) P10(-5.611,-4.355)
  round 2.159 hole 1.7: SHIELD0(-7.745,-1.056) SHIELD1(7.745,-1.056)
SIM-SMD_SMC-202-6
  rect 1.56x2.61 smd: 7(-8.225,5.075) 8(-8.225,-7.543) 9(8.225,-7.537) 10(8.225,5.087)
  rect 0.9x1.6 smd: C1(-5.105,7.543) C2(-2.565,7.543) C3(-0.025,7.543) C5(-6.375,7.543) C6(-3.835,7.543) C7(-1.295,7.543)
SMA_L4.4-W2.6-LS5.0-BI
  rect 2x1.8 smd: 1(-2,0) 2(2,0)
SMB_L4.3-W3.6-LS5.4-BI
  rect 2.047x2.241 smd: 1(-2.591,0) 2(2.591,0)
SMD_BD5.6-D4.1
  custom 3.1x3.1 smd: 1(-2.102,1.65) 2(1.65,2.102) 3(2.102,-1.65) 4(-1.65,-2.102)
SMD_SMTSO3060CTJ
  custom 3.197x3.278 smd: 1(1.79,2.34)
  custom 3.279x3.197 smd: 2(1.768,-2.386) 4(-1.769,2.386)
  custom 3.197x3.279 smd: 3(-1.79,-2.369)
SOD-123F_L2.7-W1.6-LS3.8-RD
  rect 1.1x1 smd: 1(-1.735,0) 2(1.735,0)
SOD-523_L1.2-W0.8-LS1.6-FD
  rect 0.6x0.6 smd: 1(-0.8,0) 2(0.8,0)
SOIC-8_L5.0-W4.0-P1.27-LS6.0-BL
  oval 0.569x1.95 smd: 1(-1.905,-2.705) 2(-0.635,-2.705) 3(0.635,-2.705) 4(1.905,-2.705) 5(1.905,2.705) 6(0.635,2.705) 7(-0.635,2.705) 8(-1.905,2.705)
SOIC-8_L5.0-W4.0-P1.27-LS6.0-BL-EP2.0
  oval 0.574x2.038 smd: 1(-1.905,-2.769) 2(-0.635,-2.769) 3(0.635,-2.769) 4(1.905,-2.769) 5(1.905,2.769) 6(0.635,2.769) 7(-0.635,2.769) 8(-1.905,2.769)
  rect 2x2 smd: 9(0,0)
SOIC-14_L8.7-W3.9-P1.27-LS6.0-BL
  oval 0.574x2.038 smd: 1(-3.81,-2.769) 2(-2.54,-2.769) 3(-1.27,-2.769) 4(0,-2.769) 5(1.27,-2.769) 6(2.54,-2.769) 7(3.81,-2.769) 8(3.81,2.769) 9(2.54,2.769) 10(1.27,2.769) 11(0,2.769) 12(-1.27,2.769) 13(-2.54,2.769) 14(-3.81,2.769)
SOP-8_L4.9-W3.9-P1.27-LS6.0-BL
  oval 0.63x1.865 smd: 1(-1.905,-2.683) 2(-0.635,-2.683) 3(0.635,-2.683) 4(1.905,-2.683) 5(1.905,2.683) 6(0.635,2.683) 7(-0.635,2.683) 8(-1.905,2.683)
SOT-23-3_L2.9-W1.3-P1.90-LS2.4-BR
  rect 1.25x0.7 smd: 1(1,-0.95) 2(1,0.95) 3(-1,0)
SOT-23-3_L3.0-W1.7-P0.95-LS2.9-BR
  rect 1.038x0.532 smd: 1(1.101,-0.95) 2(1.101,0.95) 3(-1.101,0)
SOT-23-5_L3.0-W1.7-P0.95-LS2.8-BR
  rect 1x0.6 smd: 1(1.3,-0.95) 2(1.3,0) 3(1.3,0.95) 4(-1.3,0.95) 5(-1.3,-0.95)
SOT-23_L2.9-W1.3-P1.90-LS2.4-BR
  rect 1x0.8 smd: 1(1.15,-0.95) 2(1.15,0.95) 3(-1.15,0)
SSOP-28_L9.9-W3.9-P0.64-LS6.0-BL
  oval 0.355x1.935 smd: 1(-4.128,-2.717) 2(-3.493,-2.717) 3(-2.857,-2.717) 4(-2.223,-2.717) 5(-1.587,-2.717) 6(-0.953,-2.717) 7(-0.318,-2.717) 8(0.318,-2.717) 9(0.953,-2.717) 10(1.587,-2.717) 11(2.223,-2.717) 12(2.857,-2.717) 13(3.493,-2.717) 14(4.128,-2.717) 15(4.128,2.717) 16(3.493,2.717) 17(2.857,2.717) 18(2.223,2.717) 19(1.587,2.717) 20(0.953,2.717) 21(0.318,2.717) 22(-0.318,2.717) 23(-0.953,2.717) 24(-1.587,2.717) 25(-2.223,2.717) 26(-2.857,2.717) 27(-3.493,2.717) 28(-4.128,2.717)
SW-TH_SHOU_MSS22D18G2
  round 1.6 hole 1: 1(-2.5,1.675) 2(0,1.675) 3(2.5,1.675) 4(-2.5,-1.675) 5(0,-1.675) 6(2.5,-1.675)
test-point-0.5mm
  round 0.8 smd: 1(0,0)
TF-SMD_TF-PUSH
  rect 0.7x1.6 smd: 1(2.25,5.3) 2(1.15,5.3) 3(0.05,5.3) 4(-1.05,5.3) 5(-2.15,5.3) 6(-3.25,5.3) 7(-4.35,5.3) 8(-5.45,5.3) CD(-6.55,5.3)
  rect 1.2x1.5 smd: 10(-7.75,4.3)
  rect 1.2x2.2 smd: 11(-7.75,-5.3) 12(7.75,-5.3)
  rect 1.6x1.5 smd: 13(6.85,4.3)
USB-A-TH_AF-SS-JB17.6
  rect 1.6x1.6 hole 1: 1(-3.5,2.45) 5(-3.5,-0.15)
  round 1.6 hole 1: 2(-1,2.45) 3(1,2.45) 4(3.5,2.45) 6(-1,-0.15) 7(1,-0.15) 8(3.5,-0.15)
  round 3 hole 2.3: 9(-6.55,2.85) 10(6.55,2.85) 11(-6.55,-2.85) 12(6.55,-2.85)
VSSOP-10_L3.0-W3.0-P0.50-LS4.9-BL
  rect 0.3x1.3 smd: 1(-1,-2.35) 2(-0.5,-2.35) 3(0,-2.35) 4(0.5,-2.35) 5(1,-2.35) 6(1,2.35) 7(0.5,2.35) 8(0,2.35) 9(-0.5,2.35) 10(-1,2.35)

## Nets
As in the schematic, except:
CAMERA_GPIO: FPC8.6 U45.97
PI_NLED_ACTIVITY: R126.1 U45.21

Pads without a net: CARD1 CD; CARD2 C6; CN3 1 8 20 21 22 23 24 25 26 28 29 31 35 37 38 40 41 42 43 44 46 47 48 49 50 52 53 54 55 56 58 59 60 61 63 66 68 69 75; CN5 1 5 6 7 8 11 13 17 19 20 21 22 23 24 25 26 28 29 30 31 32 34 35 36 37 38 40 42 44 46 48 54 56 58 67 68 69 75; CN20 2; FPC8 5; SW1 3 6; U8 5; U10 6 7 22 23 24 25 27; U12 2 3 4; U19 7; U22 1 2 3; U45 16 18 19 20 25 27 29 35 36 37 41 45 49 64 68 70 72 73 76 88 89 90 91 92 94 95 96 99 100; U46 104 106 111 128 130 134 136 140 142 143 145 146 147 148 149 152 154 157 158 159 160 163 164 165 166 169 171 175 177 181 183 187 189 193 194 195 196; U48 2 3 4; USB8 4

## Via types
v1: diameter 0.61, hole 0.305, Top Layer to Bottom Layer, 353 vias
v2: diameter 0.63, hole 0.3, Top Layer to Bottom Layer, 16 vias
v3: diameter 0.8, hole 0.5, Top Layer to Bottom Layer, 5 vias

## Routing (per net, layer and track width the routed paths; a pad name or vN(x,y) marks a point on that pad's centre or on a via; arc(x,y) is an arc through that point)
3.3V-SSD: length 85.2
  Top Layer w0.213: R18.2 60.21,67.84 60.21,74.55 62.01,76.35 72.93,76.35 73.31,75.97 73.31,72.78 L3.2
  Top Layer w0.254: LED10.2 76.1,73.9 76.1,72.07 76.02,72 ; 73.08,72.76 73.84,72 72.44,72 ; R13.1 81.2,71.63 80.83,72 76.02,72 ; 76.02,72 74.09,72 L3.2
  Top Layer w0.3: 73.09,49.4 73.59,49.9 74.77,49.9 ; 73.09,49.4 73.59,48.9 74.77,48.9 ; 73.09,49.4 73.08,49.39 ; 73.09,49.4 74.77,49.4 ; 72.7,64.4 72.71,64.4 74.77,64.4 ; 74.77,63.9 72.75,63.9 72.7,63.95 ; 72.7,66.9 72.71,66.9 74.77,66.9 ; 74.77,63.4 72.75,63.4 72.7,63.44 ; 74.77,66.4 72.75,66.4 72.7,66.45 ; 74.77,62.9 72.72,62.9 72.7,62.92
  Top Layer w1: 72.68,68.09 72.68,72.36 73.08,72.76 ; 72.68,68.09 72.7,68.06 72.68,68.03 72.68,66.93 72.7,66.9 72.68,66.87 72.68,66.47 72.7,66.45 72.68,66.42 72.68,64.43 72.7,64.4 72.68,64.37 72.68,63.98 72.7,63.95 72.68,63.92 72.68,63.47 72.7,63.44 72.68,63.42 72.68,62.94 72.7,62.92 72.68,62.89 72.68,49.8 73.08,49.39 ; 72.68,68.09 72.56,68.2 C16.2 C15.2
24V-IN: length 7.1
  Top Layer w1: CN7.10 13.75,2.56 13.75,9.34 F1.1
+1.8V: length 2
  Top Layer w0.254: CN3.65 21.47,28.61 R165.2
+3.3V: length 425.2
  Top Layer w0.127: LED15.2 23.99,21.83 R120.2 ; 110.73,24.54 110.73,24.53 112.01,24.53 ; 84.49,83.63 84.43,83.57 83.02,83.57 81.98,84.61 81.98,88.84 81.48,89.33 75.72,89.33 ; U19.8 75.61,89.29 C51.2 ; R117.2 37.36,22.2 LED18.2 ; LED16.2 28.23,21.49 R119.2 ; 114.04,24.72 113.86,24.54 112.01,24.53 ; 112.01,24.53 112.02,24.53 ; R118.2 32.57,21.01 LED17.2
  Top Layer w0.2: v2(84.06,25.88) 83.25,25.88 R138.2 83.01,25.7 81.73,25.7 ; 138.35,61.99 135.25,61.99 134.51,61.26 134.51,59.07 CN21.1 ; 81.18,42.25 82.65,42.25 83.94,40.96 v2(83.94,31.1) ; 118.31,67.56 117.36,67.56 117.13,67.33 117.29,67.16 U45.84 118.95,67.16 119.16,66.95 119.16,66.19 118.93,65.96 118.31,65.96 ; 80.32,24.29 81.69,25.66 R137.2
  Top Layer w0.254: R179.2 126.66,74.13 128.13,74.13 ; R118.2 32.54,16.08 32.6,16.01 ; 32.6,16.01 27.71,16.01 ; 32.6,16.01 37.42,16.01 ; 27.71,16.01 23.54,16.01 22.89,16.66 22.89,20.6 23.14,20.85 ; 27.71,16.01 27.71,16.02 R119.2 ; v1(84.49,80.38) 84.49,83.63 84.92,84.06 86.14,84.06 86.51,84.43 86.51,85.1 ; 48.1,13.1 46.77,13.1 46.39,12.72 U23.8 ; 48.1,13.1 48.16,13.17 ; 48.1,13.1 48.1,13.2 ; 48.16,14.76 48.1,14.69 48.1,13.2 ; 48.16,14.76 42.82,14.76 41.57,16.01 37.42,16.01 ; 48.16,14.76 48.17,14.75 48.93,14.75 49.31,15.13 49.31,16.78 49.94,17.42 49.94,19.2 49.62,19.52 C69.2 47.87,19.52 U24.14 ; 37.42,16.01 37.36,16.07 R117.2 ; 126.6,74.13 125.14,74.13 R178.2 ; 48.1,13.2 49.66,13.2 C68.2 ; v1(46.18,15.28) 46.18,14.79 ; C61.1 69.18,27.36 U22.4 ; 128.2,74.14 128.21,74.13 128.62,74.13 129.06,74.57 129.06,82.56 128.81,82.81 128.81,83.51 127.62,84.7 CN17.2 ; U28.1 81.26,42.33 C72.2 ; v1(69.16,30.36) 69.16,29.32 ; v1(115.87,68.12) 115.87,67.39 ; FPC8.1 86.59,85.25 C31.1 ; v1(128.2,73.02) v2(116.36,73.02) ; v1(54.51,19.08) 54.53,19.07 D3.2
  Top Layer w0.3: R173.2 128.2,74.14 v1(128.2,73.02) ; CARD1.4 130.68,56.38 C18.2 130.27,58.44 C30.2 ; 54.51,15.88 54.51,17.66 54.53,17.67 ; C62.2 80.33,24.23 78.67,24.23 ; 130.22,58.5 130.4,58.68 v1(130.4,61.56) ; D29.2 64.56,16.46 D28.2 ; v1(124.76,60.52) 124.76,60.52 LED13.2 ; D34.2 74.22,18.12 74.36,18.26 ; v1(76.09,20.74) 76.09,22.08 ; v1(74.68,19.33) 74.68,18.47 74.5,18.28 ; v1(64.87,19.08) 64.57,18.77 64.57,17.92 ; C63.2 78.69,23.59 78.36,23.26 76.42,23.26 76.1,22.94 U8.8
  Top Layer w0.4: 116.62,67.33 117.13,67.33 ; v1(110.6,23.74) 110.73,23.86 110.73,66.1 111.95,67.32 116.55,67.32
  Inner1 w0.2: v2(84.06,25.88) 84.06,30.97 v2(83.94,31.1)
  Inner1 w0.254: v1(69.16,30.36) 69.04,30.36 67.51,28.83 67.51,19.08 ; v1(46.18,15.28) 49.98,19.08 v1(54.51,19.08) v1(64.87,19.08) ; v2(116.36,73.02) 115.87,73.02 ; 115.87,73.02 115.87,73.64 113.3,76.21 88.17,76.21 84.49,79.89 v1(84.49,80.38) ; 115.87,73.02 v1(115.87,68.12) ; v1(110.6,23.74) 110.6,21.59 109.68,20.67 75.29,20.67 73.7,19.08 67.51,19.08 ; 67.51,19.08 65.06,19.08
  Inner1 w0.3: v1(64.87,19.08) 65.06,19.08 ; v1(74.68,19.33) 74.37,19.63
  Bottom Layer w0.2: v1(130.4,61.56) 133.84,61.56 134.51,60.89 134.51,59.07 CN21.1
  Bottom Layer w0.3: v1(124.76,60.52) 129.36,60.52 v1(130.4,61.56) 131.08,62.24 131.08,72.04 130.1,73.02 v1(128.2,73.02)
  Bottom Layer w0.4: v1(110.6,23.74) 110.6,5.26 112.55,3.32 114.83,3.32 ; 114.83,3.32 114.83,1.4 RJ2.11 ; 114.83,3.32 127.53,3.32 128.06,2.79 RJ2.14
+3.7V: length 82.4
  Top Layer w0.254: R10.1 33.23,28.08 33.49,28.33 33.49,40.48 33.66,40.66 ; 4.55,44.98 11.21,44.98 11.59,44.6 11.59,42.14 L1.2 ; 4.55,44.98 3.33,44.98 2.69,44.34 2.69,41.81 ; 4.55,44.98 4.57,45 LED8.2 ; CN3.4 36.72,38.9 35.85,39.77 35.85,40.66 ; 36.27,40.11 39.44,40.11 R11.1 ; 36.27,40.11 36.1,40.28 ; 36.27,40.11 37.22,39.16 CN3.2
  Top Layer w0.3: CN3.74 19.22,40.56 19.32,40.66 ; CN3.70 20.22,40.59 20.29,40.66 ; CN3.72 19.72,40.66 19.72,40.66
  Top Layer w1.5: L1.2 11.6,38.45 C6.2 C7.2
  Top Layer w2.5: 11.84,40.41 12.1,40.66 35.85,40.66
+5V: length 182.8
  Top Layer w0.127: 51.33,36.18 51.3,36.16 LED7.2 ; 122.62,67.57 122.62,66.77
  Top Layer w0.2: U45.85 122.61,67.56 122.62,67.57 122.62,67.63 122.29,67.96 U45.87 ; 122.62,67.14 122.6,67.16 U45.83 ; U10.20 75.66,36.25 v2(76.09,35.82) ; U45.81 122.61,66.76 122.62,66.77 122.62,66.34 ; 122.62,66.34 122.6,66.36 U45.79 ; 122.62,66.34 122.62,66.22 122.37,65.98 121.21,65.98 U45.77
  Top Layer w0.213: R60.2 63.67,39.47 v2(63.89,39.25)
  Top Layer w0.254: U41.5 98.1,16.92 98.1,18.1 ; v2(94.42,18.34) 97.79,18.34 98.04,18.1 ; v2(80.87,18.1) 81.67,18.1 81.98,17.79 ; C85.2 98.13,18.16 R162.1
  Top Layer w0.6: R185.2 82.16,14.24 81.55,14.85 81.55,16.14 ; C70.2 81.57,16.21 81.57,17.38 R130.1 82.05,17.87 U25.5
  Top Layer w1.2: 50.83,33.42 v3(48.63,33.42) ; L4.2 51.41,33.98 C36.2 C37.2 ; v3(122.68,67.08) 122.62,67.08
  Inner1 w0.2: v2(76.09,35.82) 76.09,31.77 76.03,31.71
  Inner1 w0.213: 63.83,31.83 63.89,31.89 v2(63.89,39.25)
  Inner1 w0.254: 79.46,31.71 v2(79.46,22.82)
  Inner1 w1.2: v3(122.68,67.08) 120.72,65.12 118.82,65.12 117.59,63.89 117.59,54.51 114.53,51.45 93.01,51.45 83.88,42.31 83.88,34.65 80.87,31.65 62.24,31.65 59.91,29.32 50.59,29.32 48.63,31.28 v3(48.63,33.42)
  Bottom Layer w0.254: v2(94.42,18.34) 94.17,18.09 80.88,18.09 v2(80.87,18.1) 80.87,21.41 v2(79.46,22.82)
+24V: length 172.9
  Top Layer w0.127: v2(62.73,38.33) 62.73,36.86 62.52,36.65 R78.1 ; v2(62.3,71.92) 63.3,71.92 63.4,71.82
  Top Layer w0.254: C38.1 9.63,22.88 5.98,22.88 R59.2 ; C2.2 10.6,29.86 C40.2 ; 11.91,18.44 11.92,18.43 16.41,18.43 16.96,17.89 D44.2
  Top Layer w0.8: C12.2 68.22,60.46 66.96,60.46 66.11,61.31 U4.8 ; 10.5,26.5 10.62,26.62 v3(11.79,26.62) ; C11.2 68.35,60.5 68.31,60.46 ; v3(55.19,46.85) 55.19,45.56 55.13,45.5 ; C32.2 52.7,45.38 55.19,45.38 ; 68.24,60.46 v3(68.24,58.8) ; C2.2 C3.2 7.78,30.15 U3.8 ; C33.2 55.36,45.5 56.6,45.5 57.25,44.85 U14.8
  Top Layer w1: C2.2 10.47,23.72 C38.1 10.45,23.08 10.45,20.21 11.91,18.75 Q2.2
  Inner1 w0.127: v3(68.24,58.8) 67.51,59.54 60.77,59.54 59.97,60.34 59.97,69.59 v2(62.3,71.92)
  Inner1 w0.8: v3(11.79,26.62) 13.32,28.15 13.32,32.32 14.55,33.55 39.37,33.55 41.46,35.63 41.46,45.87 43.54,47.95 55.19,47.95 ; v3(68.24,58.8) 68.24,50.1 66.1,47.95 55.19,47.95 ; 55.19,47.95 v3(55.19,46.85)
  Bottom Layer w0.127: v3(55.19,46.85) 55.8,46.24 62.54,46.24 63.16,45.62 63.16,38.76 v2(62.73,38.33)
GND: length 175.2
  Top Layer w0.127: U45.71 121.18,64.75 119.92,64.75 ; U45.42 119.57,58.76 v1(119.8,58.99) 119.97,59.16 U45.43 ; CN5.15 83.27,63.65 83.58,63.96 U46.168 ; U45.65 119.88,63.56 v1(119.86,63.58) ; U28.5 83.23,45.6 83.26,45.56 ; v1(119.86,63.58) 119.92,63.65 119.92,64.75 ; v1(119.86,63.58) 119.84,63.56 U45.66 117.55,63.56 117.53,63.58 ; 117.41,62.54 117.59,62.36 U45.60 119,62.36 119.37,61.99 119.37,60.76 ; CN5.33 83.43,59.15 83.45,59.17 84.38,59.17 U46.144 ; 84.43,57.94 v1(85.96,57.94) ; U46.197 86.57,69.96 86.45,69.84 ; CN5.3 80.59,66.65 v1(80.55,66.69) ; 86.63,54.63 86.91,54.36 U46.119 ; U45.23 120.14,55.16 v1(119.92,54.94) 119.74,54.76 U45.22 ; v1(105.02,3.76) 105.02,4.86 105.21,5.04 CN20.10 ; 86.51,57.82 86.65,57.96 U46.137 ; 88.66,65.12 88.61,65.16 U46.173 ; 119.92,64.75 119.51,65.16 U45.74 117.76,65.16 117.59,64.99 ; 83.57,51.88 83.65,51.96 U46.108 85.38,51.96 85.47,51.88 85.65,51.88 ; U45.59 120.6,62.36 120.47,62.24 120.47,61.19 ; CN20.16 104.01,5.38 103.86,5.23 102.72,5.23 102.11,5.84 ; 82.04,59.11 v1(80.57,59.11) ; CN5.39 82.05,57.64 ; 82.05,57.64 80.63,57.64 ; 82.05,57.64 82.96,57.64 83.26,57.94 ; U46.120 84.8,54.36 85.02,54.57 85.16,54.57 ; 95.58,90.25 95.59,90.24 FPC8.19 ; 86.63,68.67 86.72,68.76 U46.191 88.94,68.76 89.02,68.67 ; 88.23,69.65 87.92,69.96 87.43,69.96 ; CN5.45 82.02,56.11 v1(80.57,56.11) ; 83.39,62.73 84.36,62.73 U46.162 ; 88.9,63.95 88.89,63.96 U46.167 ; v1(105.88,9.03) 105.82,8.97 105.82,8.54 105.81,8.52 105.81,7.25 ; 106.41,6.02 106.41,5.38 106.62,5.17 106.99,5.17 ; 88.29,53.04 88.17,53.16 U46.113 ; 119.25,69.9 119.18,69.96 U45.98 ; v1(104.47,9.03) 104.47,8.66 104.61,8.52 104.61,7.25 ; 82.04,63.65 80.55,63.65 ; 83.45,49.24 83.39,49.18 82.04,49.18 ; U45.14 119.86,53.16 v1(119.86,53.16) 121.19,53.16 U45.13 ; U45.8 117.49,51.96 v1(117.28,51.75) ; 85.59,55.55 85.58,55.56 U46.126 ; U45.52 119.73,60.76 v1(119.8,60.83) 120.13,61.16 U45.53 ; 85.71,61.56 U46.156 83.45,61.56 ; 85.9,51.88 85.98,51.96 U46.107 88.62,51.96 88.66,52 ; U45.33 122.24,57.16 v1(122.25,57.15) ; U46.179 88.8,66.36 88.84,66.4 ; 85.1,69.9 85.04,69.96 U46.198 ; U46.161 87.44,62.73 v1(85.9,62.73) ; 86.14,55.55 87.46,55.55 U46.125 ; U46.180 84.37,66.34 83.51,66.34 ; 83.57,68.76 U46.192 85.01,68.76 85.1,68.86 ; U45.1 121.21,50.75 v1(121.21,50.1) ; 121.21,64.75 122,64.75 122.07,64.81 ; U46.185 88.83,67.56 88.84,67.57 ; U46.138 84.38,57.94 83.51,57.94 ; CN5.57 80.47,53.15 v1(80.42,53.11) ; U46.132 85.7,56.76 85.72,56.78 ; U46.114 84.86,53.16 85.1,52.92 ; 86.45,56.78 87.45,56.78 U46.131 ; 82.06,60.64 83.26,60.64 83.54,60.36 U46.150 85.38,60.36 85.41,60.34 ; 82.06,60.64 v1(80.57,60.64) ; 82.06,60.64 CN5.27 ; U45.2 118.51,50.04 ; 84.37,69.96 83.57,69.96 83.51,69.9 ; FPC8.13 92.59,90.18 92.58,90.19 ; 84.43,59.17 85.59,59.17 ; 82.04,66.65 83.26,66.65 83.51,66.4 v1(83.51,67.57) 83.52,67.56 U46.186 ; 86.14,61.5 87.41,61.5 U46.155 ; 83.63,49.65 CN5.71 80.78,49.65 v1(80.55,49.42) 80.82,49.15 CN5.73 ; v1(122.31,52.18) 122.09,51.96 U45.7 ; CN5.51 82.04,54.63 v1(80.55,54.63) ; v1(80.55,65.17) 80.57,65.15 CN5.9 84.38,65.15 U46.174
  Top Layer w0.178: v1(122.85,21.1) 122.84,21.09 U20.8 U20.3 ; v1(119.28,21.1) U21.8 U21.3
  Top Layer w0.2: CN3.45 26.47,31.68 26.44,31.71 ; 37.84,28.89 37.78,28.95 37.23,28.95 36.98,29.2 36.98,30.05 ; 23.5,30.11 23.5,28.64 23.43,28.58 ; 27.97,30.05 27.97,31.77 ; CN3.11 34.97,31.4 v1(35.08,31.52) ; 122.13,59.11 122.08,59.16 U45.43 ; U31.3 U31.8 89.69,14.37 89.7,14.36 v1(89.82,14.36) ; CN3.33 29.47,31.76 v1(29.46,31.77) ; CN3.39 27.97,28.71 27.91,28.64 ; v1(19.46,31.77) 19.47,31.76 CN3.73 ; 29.38,28.64 29.44,28.7 29.44,30.05 ; 26.44,28.77 26.5,28.83 26.5,30.05 ; 121.94,55.19 121.92,55.16 U45.23 ; 24.97,28.83 24.97,28.83 CN3.51 ; 19.94,30.05 19.94,28.4 ; CN3.27 30.97,31.72 v1(31.02,31.77) ; U45.32 119.41,56.76 119.43,56.78 ; 19.33,28.4 19.45,28.52 19.45,30.05 ; 117.59,54.57 117.78,54.76 U45.22 ; 30.97,29.99 30.91,29.93 30.91,28.95 ; 24.97,30.05 24.97,31.52 25.09,31.65 ; 36.55,31.59 36.47,31.5 CN3.5 ; v1(36.99,31.52) 36.97,31.5 CN3.3 ; CN3.57 23.47,31.71 v1(23.53,31.77) ; 117.53,53.35 117.72,53.16 U45.14 ; CN3.71 19.97,31.49 19.94,31.52 20.06,31.65 20.06,31.71 ; U45.33 121.18,57.15 120.47,57.15 ; U45.98 117.29,69.96
  Top Layer w0.254: R81.1 1.19,36.44 U3.4
  Top Layer w0.3: U33.8 U33.3 v1(31.78,59.58) ; U8.3 76.1,25.73 v1(76.6,25.22) 77.1,25.71 U8.1
  vias: v1(1.37,20.8) v1(1.49,69.84) v1(1.95,34.18) v1(7.17,35.4) v1(7.93,31.97) v1(8.3,26.56) v1(9.53,34.36) v1(10.19,72.29) v1(10.22,47.81) v1(10.47,31.97) v1(11.86,35.4) v1(11.86,33.19) v1(12.28,89.51) v1(13.56,36.19) v1(13.62,43.96) v1(15.02,46.37) v1(15.14,44.98) v1(15.14,35.2) v1(15.27,67.08) v1(15.96,23.37) v1(16.8,30.88) v1(16.92,43.83) v1(16.92,36.21) v1(17.86,28.64) v1(17.94,15.89) v1(18.63,43.86) v1(19.14,24.78) v1(19.14,21.35) v1(19.63,28.4) v1(20.28,43.86) v1(21.93,43.86) v1(23.43,28.46) v1(24.16,17.8) v1(24.8,44.72) v1(26.57,45.99) v1(27.84,67.08) v1(27.85,51.08) v1(27.85,47.83) v1(27.97,31.77) v1(28.64,28.4) v1(28.96,64.05) v1(28.96,17.8) v1(29.24,44.6) v1(31.15,43.83) v1(32.54,65.04) v1(32.51,15.03) v1(32.79,43.83) v1(33.11,53.22) v1(33.81,17.8) v1(34.47,43.83) v1(35,65.04) v1(36.1,43.83) v1(36.48,53.23) v1(38.58,28.64) v1(38.64,17.8) v1(39.25,25.27) v1(39.66,53.23) v1(39.66,30.88) v1(41.58,11.91) v1(42.58,10.43) v1(43.72,34.56) v1(44.03,57.94) v1(45.32,21.66) v1(46.18,90.25) v1(47.46,0.87) v1(47.65,18.04) v1(48.63,62.54) v1(48.63,53.1) v1(49.69,9.81) v1(49.69,8.27) v1(50.25,16.52) v1(51.82,21.23) v1(52.61,43.42) v1(53.16,57.94) v1(53.9,41.03) v1(54.7,39.8) v1(54.7,37.78) v1(55.13,43.42) v1(55.19,40.9) v1(56.04,13.99) v1(56.35,20.06) v1(56.72,42.13) v1(57.09,46.91) v1(57.29,9.54) v1(58.68,7.25) v1(58.71,10.43) v1(60.1,16.4) v1(60.64,61.82) v1(61.07,40.17) v1(62.29,66.54) v1(62.6,45.01) v1(63.47,58.15) v1(64.95,58.15) v1(65.92,50.28) v1(65.95,14.12) v1(66.06,33.31) v1(67.21,9.54) v1(68.18,84.49) v1(68.24,64.97) v1(68.24,62.48) v1(68.54,10.48) v1(68.49,7.31) v1(69.11,39.28) v1(69.12,23.39) v1(69.46,64.97) v1(69.84,32.87) v1(70.02,16.36) v1(70.67,64.97) v1(70.64,62.48) v1(74.01,26.25) v1(75.72,43.6) v1(75.86,14.27) v1(76.95,87.98) v1(76.95,9.54) v1(77.01,0.81) v1(78.39,10.43) v1(78.67,26.5) v1(79.22,68.24) v1(79.34,47.59) v1(79.91,19.7) v1(79.91,16.53) v1(80.55,63.65) v1(81.3,69.47) v1(81.91,74.31) v1(82.28,40.84) v1(82.28,38.51) v1(82.71,30.79) v1(82.96,45.13) v1(83.14,88.04) v1(83.32,47.77) v1(83.98,16.15) v1(84.06,85.1) v1(84.8,89.7) v1(85.25,18.82) v1(85.47,77.62) v1(85.53,31.1) v1(87.61,23.25) v1(88.11,88.04) v1(88.78,52) v1(88.96,62.91) v1(89.56,85.99) v1(91.11,88.04) v1(93.56,50.16) v1(93.5,13.99) v1(94.11,88.04) v1(97.12,88.04) v1(97.79,59.48) v1(98.1,11.85) v1(98.89,86.39) v1(98.89,15.1) v1(99.26,78.17) v1(99.26,73.15) v1(99.26,69.29) v1(99.32,62.97) v1(100.49,19.75) v1(100.61,88.04) v1(100.67,28.28) v1(100.67,24.11) v1(103.92,70.39) v1(106.31,45.87) v1(106.43,16.02) v1(106.5,62.97) v1(108.33,63.03) v1(110.6,73.09) v1(111.71,5.9) v1(113.05,18.47) v1(115.63,64.2) v1(117.28,69.96) v1(118.51,50.04) v1(121.33,1.92) v1(121.82,6.64) v1(123.97,55.25) v1(123.97,45.99) v1(127.92,58.44) v1(128.5,53.72) v1(129.36,90.07) v1(139.48,46.11) v1(139.6,20.86) v1(139.72,70.2)
1WIRE: length 23.2
  Top Layer w0.127: v2(122.37,60.76) 122.37,60.76 U45.51
  Top Layer w0.2: 139.86,61.99 139.86,61.4 139.54,61.07 136.9,61.07 136.59,60.76 136.59,59.11 CN21.2
  Inner1 w0.127: CN21.2 136.53,60.09 136.17,60.46 130.1,60.46 129.54,59.91 122.8,59.91 122.37,60.34 v2(122.37,60.76)
485-A: length 12.8
  Top Layer w0.3: CN10.1 50.45,5.3 47.67,8.09 46.06,8.09 45.87,8.27 ; 45.87,8.27 R112.1 ; 45.87,8.27 44.35,8.27 43.85,8.78 U23.6
485-B: length 14
  Top Layer w0.3: CN10.2 52.99,5.03 50.51,7.51 49.31,7.51 48.55,8.27 48.55,9.54 48.16,9.93 47.51,9.93 47.44,9.99 46.08,9.99 R112.2 45.38,9.79 45.12,10.05 U23.7
ADC-SCL: length 72.6
  Top Layer w0.127: v1(111.46,26.13) 111.46,53.96 113.46,55.96 U45.28
  Top Layer w0.178: U8.10 80.65,22.11 81.67,23.13 81.67,24.19 81.69,24.21 ; v1(87.61,25.64) 84.86,25.64 84.18,24.97 81.98,24.97 81.73,24.72 81.73,24.23
  Bottom Layer w0.127: v1(87.61,25.64) 110.97,25.64 v1(111.46,26.13)
ADC-SDA: length 77.6
  Top Layer w0.127: v1(112.26,26.13) 112.63,26.5 112.63,27.36 112.2,27.79 112.2,53.84 113.36,55 v1(116,55) ; U45.31 120.64,56.76 v1(119.74,55.86)
  Top Layer w0.178: R138.1 83.02,24.15 83.02,23.31 80.81,21.1 76.77,21.1 76.6,21.27 U8.9 ; v1(87.61,24.78) 87.43,24.97 84.86,24.97 84.06,24.17 83.02,24.17
  Bottom Layer w0.127: v1(116,55) 116.86,55.86 v1(119.74,55.86) ; v1(87.61,24.78) 88.11,25.27 111.4,25.27 v1(112.26,26.13)
ANALOG-OUT0: length 11.1
  Top Layer w0.254: 71.9,19.7 71.1,19.7 C60.1 ; 71.9,19.7 71.91,19.71 v1(71.91,20.21) ; 71.9,19.7 R110.2 72.93,19.95 U22.14 ; U8.6 75.1,23.63 v1(74.83,23.9)
  Bottom Layer w0.254: v1(71.91,20.21) 71.91,20.97 v1(74.83,23.9)
ANALOG-OUT1: length 20
  Top Layer w0.254: C58.1 62.76,19.32 R103.2 62.77,20.22 64.31,21.76 U22.8 65.31,22.88 67.09,24.66 74.96,24.66 75.6,24.02 U8.7
ANALOG-OUT2: length 30.5
  Top Layer w0.254: U22.7 65.3,27.29 65.3,25.92 v1(65.05,25.67) 65.05,25.54 61.11,21.61 54.41,21.61 52.74,19.94 R89.2 51.16,19.44 C54.1 ; v1(68.36,25.42) 75.34,25.42 75.6,25.67 U8.4
  Bottom Layer w0.254: v1(65.05,25.67) 68.11,25.67 v1(68.36,25.42)
ANALOG_INT: length 71.7
  Top Layer w0.127: U45.26 113.49,55.56 111.89,53.96 111.89,27.17 v1(112.07,26.99) ; U8.2 76.6,27.49 76.83,27.72 86.33,27.72 v1(87.61,26.44)
  Bottom Layer w0.127: v1(112.07,26.99) 111.46,26.99 110.48,26.01 88.04,26.01 v1(87.61,26.44)
C0-: length 9.9
  Top Layer w0.4: CN10.11 75.85,6.12 73.56,8.4 73.56,11.67 R105.1
C1-: length 10.8
  Top Layer w0.4: CN10.8 68.23,4.3 63.79,8.75 63.79,11.52 R98.1
C2-: length 12.9
  Top Layer w0.4: 53.16,12.47 53.75,11.88 53.75,8.78 54.51,8.02 56.28,8.02 60.57,3.73 CN10.5
CAM1_C_N: length 35.5
  Top Layer w0.127: 93.6,86.8 93.6,69.15 arc(93.66,69) 93.81,68.94 arc(93.95,68.88) 94.01,68.74 94.01,67.62 arc(93.95,67.48) 93.81,67.42 arc(93.66,67.36) 93.6,67.21 93.6,66.1 arc(93.66,65.95) 93.81,65.89 arc(93.95,65.83) 94.01,65.69 94.01,64.57 arc(93.95,64.43) 93.81,64.37 arc(93.66,64.31) 93.6,64.16 93.6,63.05 arc(93.66,62.91) 93.81,62.85 arc(93.95,62.79) 94.01,62.64 94.01,61.53 arc(93.95,61.38) 93.81,61.32 arc(93.66,61.26) 93.6,61.12 93.6,60.82 88.74,55.96 U46.127
CAM1_C_P: length 35.4
  Top Layer w0.127: U46.129 88.63,56.36 93.1,60.83 93.1,88.75
CAM1_D0_N: length 39.2
  Top Layer w0.127: U46.115 88.88,53.56 96.6,61.28 96.6,79.74 arc(96.69,79.95) 96.89,80.03 arc(97.1,80.12) 97.19,80.33 97.19,81.27 arc(97.1,81.47) 96.89,81.56 arc(96.69,81.64) 96.6,81.85 96.6,82.79 arc(96.69,83) 96.89,83.08 arc(97.1,83.17) 97.19,83.37 97.19,84.31 arc(97.1,84.52) 96.89,84.61 arc(96.69,84.69) 96.6,84.9 96.6,86.8
CAM1_D0_P: length 39.1
  Top Layer w0.127: U46.117 88.77,53.96 96.1,61.29 96.1,88.75
CAM1_D1_N: length 37.9
  Top Layer w0.127: 95.1,88.75 95.1,61.05 88.81,54.76 U46.121
CAM1_D1_P: length 38
  Top Layer w0.127: 94.6,86.8 94.6,84.94 arc(94.53,84.78) 94.37,84.71 arc(94.21,84.64) 94.14,84.48 94.14,83.42 arc(94.21,83.25) 94.37,83.18 arc(94.53,83.12) 94.6,82.95 94.6,81.89 arc(94.53,81.73) 94.37,81.66 arc(94.21,81.59) 94.14,81.43 94.14,80.37 arc(94.21,80.2) 94.37,80.14 arc(94.53,80.07) 94.6,79.9 94.6,78.84 arc(94.53,78.68) 94.37,78.61 arc(94.21,78.54) 94.14,78.38 94.14,77.32 arc(94.21,77.16) 94.37,77.09 arc(94.53,77.02) 94.6,76.86 94.6,75.8 arc(94.53,75.63) 94.37,75.56 arc(94.21,75.5) 94.14,75.33 94.14,74.27 arc(94.21,74.11) 94.37,74.04 arc(94.53,73.97) 94.6,73.81 94.6,72.75 arc(94.53,72.58) 94.37,72.52 arc(94.21,72.45) 94.14,72.28 94.14,71.22 arc(94.21,71.06) 94.37,70.99 arc(94.53,70.92) 94.6,70.76 94.6,61.06 88.7,55.16 U46.123
CAM1_D2_N: length 34.5
  Top Layer w0.127: 92.1,88.75 92.1,84.94 arc(92.14,84.85) 92.23,84.81 arc(92.32,84.78) 92.36,84.69 92.36,83.42 arc(92.32,83.33) 92.23,83.29 arc(92.14,83.25) 92.1,83.16 92.1,60.59 88.67,57.16 U46.133
CAM1_D2_P: length 34.5
  Top Layer w0.127: U46.135 88.56,57.56 91.6,60.6 91.6,70.76 arc(91.53,70.94) 91.35,71.01 arc(91.17,71.09) 91.09,71.27 91.09,72.28 arc(91.17,72.46) 91.35,72.54 arc(91.53,72.61) 91.6,72.79 91.6,73.81 arc(91.53,73.99) 91.35,74.06 arc(91.17,74.14) 91.09,74.32 91.09,75.33 arc(91.17,75.51) 91.35,75.59 arc(91.53,75.66) 91.6,75.84 91.6,76.85 arc(91.53,77.04) 91.35,77.11 arc(91.17,77.19) 91.09,77.37 91.09,78.38 arc(91.17,78.56) 91.35,78.63 arc(91.53,78.71) 91.6,78.89 91.6,79.9 arc(91.53,80.08) 91.35,80.16 arc(91.17,80.23) 91.09,80.41 91.09,81.43 arc(91.17,81.61) 91.35,81.68 arc(91.53,81.76) 91.6,81.94 91.6,82.95 arc(91.53,83.13) 91.35,83.21 arc(91.17,83.28) 91.09,83.46 91.09,84.47 arc(91.17,84.66) 91.35,84.73 arc(91.53,84.81) 91.6,84.99 91.6,86.8
CAM1_D3_N: length 31.6
  Top Layer w0.127: 90.6,86.8 90.6,70.58 arc(90.66,70.46) 90.78,70.4 arc(90.91,70.35) 90.96,70.22 90.96,69.06 arc(90.91,68.93) 90.78,68.88 arc(90.66,68.83) 90.6,68.7 90.6,67.54 arc(90.66,67.41) 90.78,67.35 arc(90.91,67.3) 90.96,67.17 90.96,66.01 arc(90.91,65.88) 90.78,65.83 arc(90.66,65.78) 90.6,65.65 90.6,64.49 arc(90.66,64.36) 90.78,64.31 arc(90.91,64.25) 90.96,64.13 90.96,62.96 arc(90.91,62.84) 90.78,62.78 arc(90.66,62.73) 90.6,62.6 90.6,60.49 88.47,58.36 U46.139
CAM1_D3_P: length 31.6
  Top Layer w0.127: U46.141 88.36,58.76 90.1,60.5 90.1,88.75
CAMERA_GPIO: length 50.1
  Top Layer w0.127: FPC8.6 89.09,86.4 88.96,86.27 88.96,72.04 v1(89.02,71.98) ; U45.97 120.65,69.96 119,71.61 v1(102.27,71.61)
  Bottom Layer w0.127: v1(89.02,71.98) 89.39,71.61 v1(102.27,71.61)
ETH_LEDG: length 36.7
  Top Layer w0.178: 121.39,53.56 121.88,53.56 123.73,51.7 125.13,51.7 128.04,48.8 128.04,22.37 127.03,21.36 R74.2
ETH_LEDY: length 37
  Top Layer w0.178: R75.2 128.55,21.09 128.38,21.27 128.38,48.97 125.26,52.09 123.86,52.09 121.98,53.96 121.39,53.96
ETH_P0_N: length 44.2
  Top Layer w0.178: RJ2.P3 118.26,15.17 118.26,16.69 118.79,17.21 U21.2 U21.9 118.79,20.65 118.71,20.72 118.71,28.91 115.73,31.89 115.73,33.05 arc(115.84,33.32) 116.11,33.43 arc(116.38,33.54) 116.49,33.81 116.49,34.58 arc(116.38,34.84) 116.11,34.96 arc(115.84,35.07) 115.73,35.34 115.73,36.1 arc(115.84,36.37) 116.11,36.48 arc(116.38,36.59) 116.49,36.86 116.49,37.62 arc(116.38,37.89) 116.11,38 arc(115.84,38.12) 115.73,38.39 115.73,39.15 arc(115.84,39.42) 116.11,39.53 arc(116.38,39.64) 116.49,39.91 116.49,40.67 arc(116.38,40.94) 116.11,41.05 arc(115.84,41.16) 115.73,41.43 115.73,42.2 arc(115.84,42.46) 116.11,42.58 arc(116.38,42.69) 116.49,42.96 116.49,43.72 arc(116.38,43.99) 116.11,44.1 arc(115.84,44.21) 115.73,44.48 115.73,51.45 116.66,52.38 117.85,52.38 117.87,52.36 118.31,52.36
